# Altium schematic sheet CPU.SchDoc
size A4
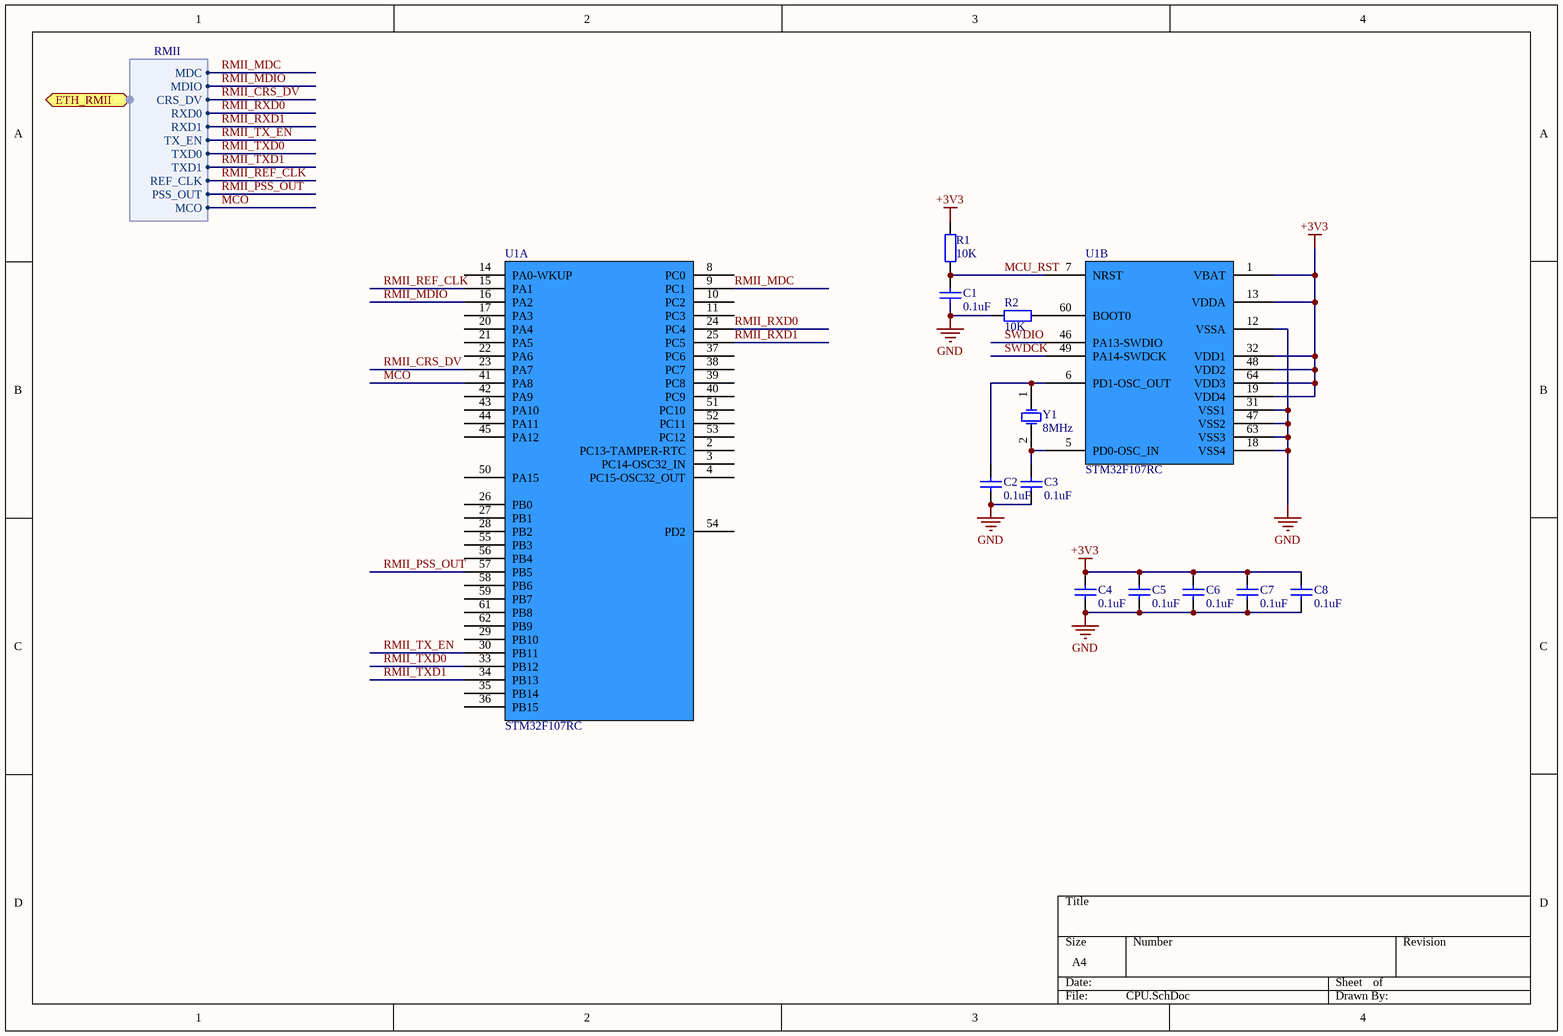
[diagram p0: CPU.SchDoc]

## Parts
C1  0.1uF  [C0805]
C2  0.1uF  [C0805]
C3  0.1uF  [C0805]
C4  0.1uF  [C0805]
C5  0.1uF  [C0805]
C6  0.1uF  [C0805]
C7  0.1uF  [C0805]
C8  0.1uF  [C0805]
R1  10K  [0805]
R2  10K  [0805]
U1  STM32F107RC  [LQFP64]  (parts A,B of 2)
Y1  8MHz  [49S_SMD]

## Ports
ETH_RMII (harness RMII)

## Harnesses
RMII: MDC, MDIO, CRS_DV, RXD0, RXD1, TX_EN, TXD0, TXD1, REF_CLK, PSS_OUT, MCO

## Nets
+3V3: C4.2 C5.2 C6.2 C7.2 C8.2 R1.1 U1.1(VBAT) U1.13(VDDA) U1.19(VDD4) U1.32(VDD1) U1.48(VDD2) U1.64(VDD3)
GND: C1.1 C2.1 C3.1 C4.1 C5.1 C6.1 C7.1 C8.1 R2.2 U1.12(VSSA) U1.18(VSS4) U1.31(VSS1) U1.47(VSS2) U1.63(VSS3)
MCO: U1.41(PA8) ; port ETH_RMII.MCO
MCU_RST: C1.2 R1.2 U1.7(NRST)
RMII_CRS_DV: U1.23(PA7) ; port ETH_RMII.CRS_DV
RMII_MDC: U1.9(PC1) ; port ETH_RMII.MDC
RMII_MDIO: U1.16(PA2) ; port ETH_RMII.MDIO
RMII_PSS_OUT: U1.57(PB5) ; port ETH_RMII.PSS_OUT
RMII_REF_CLK: U1.15(PA1) ; port ETH_RMII.REF_CLK
RMII_RXD0: U1.24(PC4) ; port ETH_RMII.RXD0
RMII_RXD1: U1.25(PC5) ; port ETH_RMII.RXD1
RMII_TX_EN: U1.30(PB11) ; port ETH_RMII.TX_EN
RMII_TXD0: U1.33(PB12) ; port ETH_RMII.TXD0
RMII_TXD1: U1.34(PB13) ; port ETH_RMII.TXD1
SWDCK: U1.49(PA14-SWDCK)
SWDIO: U1.46(PA13-SWDIO)
NetC2_2: C2.2 U1.6(PD1-OSC_OUT) Y1.1(OSC1)
NetC3_2: C3.2 U1.5(PD0-OSC_IN) Y1.2(OSC2)
NetR2_1: R2.1 U1.60(BOOT0)

Not connected (* = marked no-connect by the designer): U1 2(PC13-TAMPER-RTC) 3(PC14-OSC32_IN) 4(PC15-OSC32_OUT) 8(PC0) 10(PC2) 11(PC3) 14(PA0-WKUP) 17(PA3) 20(PA4) 21(PA5) 22(PA6) 26(PB0) 27(PB1) 28(PB2) 29(PB10) 35(PB14) 36(PB15) 37(PC6) 38(PC7) 39(PC8) 40(PC9) 42(PA9) 43(PA10) 44(PA11) 45(PA12) 50(PA15) 51(PC10) 52(PC11) 53(PC12) 54(PD2) 55(PB3) 56(PB4) 58(PB6) 59(PB7) 61(PB8) 62(PB9)

## Library data of the parts
C1-C8 = Cap: 0805贴片电容
R1 R2 = Res2: 0805贴片电阻
U1 = STM32F107Rx
Y1 = XTAL: 25MHz